# Altium project task11.3.PrjPcb
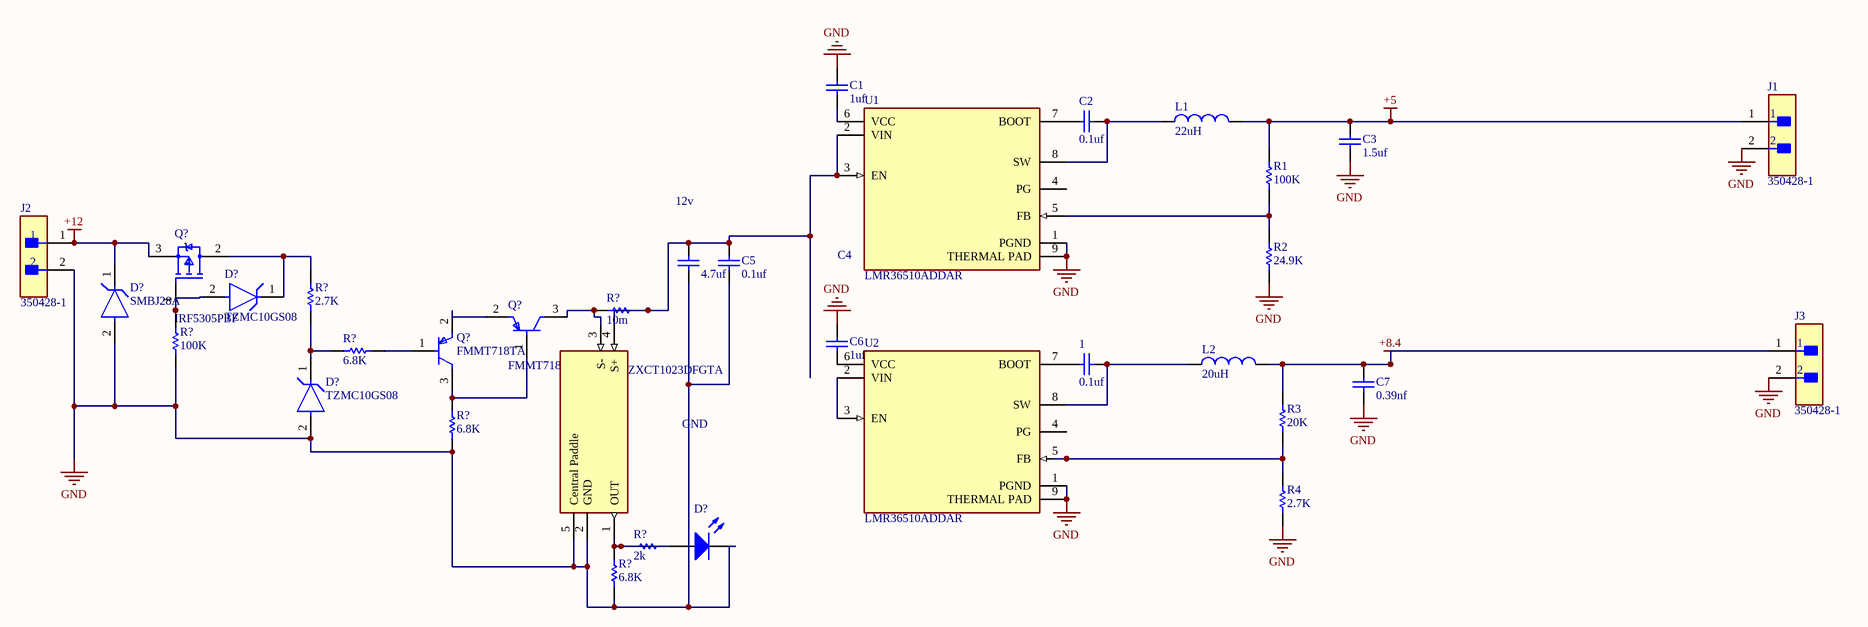
[diagram p0: Sheet1.SchDoc]
1 sheet, 34 parts. Net scope: global (net labels, ports and power ports of the same name join across sheets).
Board file: PCB1.PcbDoc

## Sheet Sheet1.SchDoc
size B; SheetNumber: 1; SheetTotal: 1

### Parts
(Parts that share a designator on the sheet are numbered #1, #2 ... from top to bottom, then left to right.)
1  value 0.1uf  (hidden comment: Capacitor)
C1  value 1uf  (hidden comment: Capacitor)
C2  value 0.1uf  (hidden comment: Capacitor)
C3  value 1.5uf  (hidden comment: Capacitor)
C4  value 4.7uf  (hidden comment: Capacitor)
C5  value 0.1uf  (hidden comment: Capacitor)
C6  value 1uf  (hidden comment: Capacitor)
C7  value 0.39nf  (hidden comment: Capacitor)
D?#1  TZMC10GS08  [FP-6_560-5005_01-4-MFG]
D?#2  SMBJ28A  [FP-SMBJ-MFG]
D?#3  TZMC10GS08  [FP-6_560-5005_01-4-MFG]
D?#4  Light-Emitting Diode  (value not drawn)
J1  350428-1  [FP-350428-1-MFG]
J2  350428-1  [FP-350428-1-MFG]
J3  350428-1  [FP-350428-1-MFG]
L1  value 22uH  (hidden comment: Inductor)
L2  value 20uH  (hidden comment: Inductor)
Q?#1  IRF5305PBF  [FP-PG-TO220-3-0]
Q?#2  FMMT718TA  [FP-SOT23-MFG]
Q?#3  FMMT718TA  [FP-SOT23-MFG]
R1  value 100K  (hidden comment: Resistor)
R2  value 24.9K  (hidden comment: Resistor)
R3  value 20K  (hidden comment: Resistor)
R4  value 2.7K  (hidden comment: Resistor)
R?#1  value 10m  (hidden comment: Resistor)
R?#2  value 2.7K  (hidden comment: Resistor)
R?#3  value 6.8K  (hidden comment: Resistor)
R?#4  value 100K  (hidden comment: Resistor)
R?#5  value 6.8K  (hidden comment: Resistor)
R?#6  value 6.8K  (hidden comment: Resistor)
R?#7  value 2k  (hidden comment: Resistor)
U1  LMR36510ADDAR  [FP-DDA0008E-IPC_A]
U2  LMR36510ADDAR  [FP-DDA0008E-IPC_A]
  ZXCT1023DFGTA  [FP-TDFN1218-4-MFG]

### Nets
+5: C3.2 J1.1 L1.2 R1.2
+8.4: C7.2 J3.1 L2.2 R3.2
+12: D?#2.1(C) J2.1 Q?#1.3(S)
GND: C1.2 C3.1 C4.1 C5.1 C6.2 C7.1 D?#2.2(A) D?#3.2(A) D?#4.2(K) J1.2 J2.2 J3.2 R2.1 R4.1 R?#4.1 R?#5.2 R?#6.2 U1.1(PGND) U1.9(THERMAL_PAD) U2.1(PGND) U2.9(THERMAL_PAD) .2(GND) .5(Central_Paddle)
Net1_1: 1.1 L2.1 U2.8(SW)
Net1_2: 1.2 U2.7(BOOT)
NetC1_1: C1.1 U1.6(VCC)
NetC2_1: C2.1 U1.7(BOOT)
NetC2_2: C2.2 L1.1 U1.8(SW)
NetC4_2: C4.2 C5.2 R?#1.1 U1.2(VIN) U1.3(EN) .4(S+)
NetC6_1: C6.1 U2.6(VCC)
NetD?#1_1: D?#1.1(C) Q?#1.2(D) R?#2.2
NetD?#1_2: D?#1.2(A) Q?#1.1(G) R?#4.2
NetD?#3_1: D?#3.1(C) R?#2.1 R?#3.2
NetD?#4_1: D?#4.1(A) R?#6.1 R?#7.1 .1(OUT)
NetQ?#2_1: Q?#2.1(B) R?#3.1
NetQ?#2_2: Q?#2.2(E) Q?#3.2(E)
NetQ?#2_3: Q?#2.3(C) Q?#3.1(B) R?#5.1
NetQ?#3_3: Q?#3.3(C) R?#1.2 .3(S-)
NetR1_1: R1.1 R2.2 U1.5(FB)
NetR3_1: R3.1 R4.2 U2.5(FB)
NetU2_2: U2.2(VIN) U2.3(EN)

Not connected (* = marked no-connect by the designer): R?#7 2; U1 4(PG); U2 4(PG)

### Notes on the sheet
- 12v
- GND

### Library data of the parts
1 C1-C7 = Capacitor: SimulationGenericComponent: True
D?#1 D?#3 = CMP-00030-07941520-1: TZMC10GS08 Diode Zener Single 10 Volt 5% 500mW 2-Pin Quadro MELF SOD-80 Tape and Reel; Forward Voltage: 1.5V; Zener Voltage: 10V; Current: 1A; Max Reverse Leakage Current: 100nA; Peak Reverse Current: 100mA; Test Current: 5mA; Impedance: 15Ω; Number of Pins: 2; Tolerance: 5%; Height: 1.6mm; Power Dissipation: 500mW; Min Operating Temperature: -65°C; NexarPartId: 7941520; Max Operating Temperature: 175°C; Lead Free: Lead Free; Width: 1.6mm; Voltage Tolerance: 5%; Element Configuration: Single; Max Power Dissipation: 500mW; Voltage: 10V; RoHS: Compliant; Radiation Hardening: No; Schedule B: 8541100050, 8541100050; Mount: Surface Mount; Working Voltage: 10V; Length: 3.7mm
D?#2 = CMP-08607-000081-1: TVS DIODE 28V 45.4V DO214AA; Manufacturer: Littelfuse Inc; Breakdown Voltage: 31.1V; Direction: Unidirectional; Number Of Channels: 1; Peak Pulse Power: 600W; Max Junction Temp: +150°C; Description: 45.4V Clamp 13.3A Ipp Tvs Diode Surface Mount DO-214AA (SMBJ); Peak Pulse Current: 13.3A; Temperature: -65°C to +150°C; Category: Diode; RoHS: TRUE; Height: 2.61mm; Reverse Standoff Voltage: 28V; Device Class L1: Circuit Protection; Temperature Range Low: -65°C; ComponentLink2Description: Datasheet; Digikey Description: TVS DIODE 28V 45.4V DO214AA; Automotive: No; Package: SMBJ; Mouser Description: Littelfuse SMBJ28A, Uni-Directional TVS Diode, 600W, 2-Pin DO-214AA; ComponentLink2URL: https://www.littelfuse.com/~/media/electronics/datasheets/tvs_diodes/littelfuse_tvs_diode_smbj_datasheet.pdf.pdf; Manufacturer Part Number: SMBJ28A; Octopart: https://octopart.com/smbj28a-littelfuse-350790; Clamping Voltage: 45.4V; Temperature Range High: +150°C; Device Class L3: unset; Device Class L2: TVS Diodes; Lead Free: Yes
D?#4 = LED: AF: 1; BV: 0; BV_MAX: 1e99; EG: 1.11; FC: 0.5; IBV: 0.001; IS: 1e-14; MJSW: 0.33; NTUN: 30; TNOM: 27; XTI: 3; SimulationGenericComponent: True; CJO: 0; CJP: 0; CTA: 0; CTP: 0; FCS: 0.5; FV_MAX: 1e99; IKF: 0; IKR: 0; ISR: 1e-14; JSW: 0; JTUN: 0; JTUNSW: 0; KEG: 1; KF: 0; LEVEL: 1; N: 1; NBV: 1; NR: 1; NS: 1; PHP: 1; RS: 0; TCV: 0; TLEV: 0; TLEVC: 0; TM1: 0; TM2: 0; TPB: 0; TPHP: 0; TRS: 0; TRS2: 0; TT: 0; TTT1: 0; TTT2: 0; VJ: 1; XTITUN: 3
J1-J3 = CMP-03369-000080-1: CONN HEADER VERT 2POS 6.35MM; Manufacturer: TE Connectivity; Standoff Height: 0.63mm; Number Of Contacts: 2; Conn Gender: Male; Voltage Rating: 600V; Conn Orientation: Vertical; Current Rating: 12A; Number Of Rows: 1; Mouser Description: Connector, Soft Shell; Universal MATE-N-LOK; 2; Nylon; Natural; 19 A; 600 VAC; Height: 14.99mm; Pitch: 6.35mm; ComponentLink2URL: https://www.te.com/commerce/DocumentDelivery/DDEController?Action=showdoc&DocId=Customer+Drawing%7F350428%7FY2%7Fpdf%7FEnglish%7FENG_CD_350428_Y2.pdf%7F350428-1; Device Class L1: Connectors; Automotive: No; Octopart: https://octopart.com/350428-1-te+connectivity-46505355; Digikey Description: CONN HEADER VERT 2POS 6.35MM; RoHS: TRUE; Temperature: -40°C to +105°C; Contact Material: Gold,Nickel; Package: 350428-1; Temperature Range Low: -40°C; Device Class L3: unset; Lead Free: Yes; Device Class L2: Headers and Wire Housings; Category: Conn; ComponentLink2Description: Datasheet; Temperature Range High: +105°C; Manufacturer Part Number: 350428-1
L1 L2 = Inductor: SimulationGenericComponent: True
Q?#1 = CMP-32901-000003-1: MOSFET P-CH 55V 31A TO-220AB; Manufacturer: Infineon; Max Forward Diode Voltage: -1.3V; Continuous Drain Current: -31A; Standoff Height: 3.55mm; Power Dissipation: 110W; Number Of Channels: 1; Rthja Max: 62°C/W; Depletion Mode: False; Drain To Source Resistance: 0.06Ω; Input Capacitace At Vds: 1200pF @ -25V; Reverse Recovery Time: 71ns; Gate Charge At Vgs: 63nC @ -10V; Gate To Source Voltage: 20V; Turn Off Delay Time: 39ns; Turn On Delay Time: 14ns; Drain To Source Breakdown Voltage: -55V; Threshold Vgs Min: -2V; Max Junction Temp: +175°C; Pulse Drain Current: -110A; Reverse Recovery Charge: 170nC; Threshold Vgs Max: -4V; Device Class L1: Discrete Semiconductors; Lead Free: Yes; Temperature Range High: +175°C; Device Class L2: Transistors; Package: PG-TO220-3; Octopart: https://octopart.com/irf5305pbf-infineon-65873396; RoHS: TRUE; Number Of P Channels: 1; Manufacturer Part Number: IRF5305PBF; Category: Trans; Digikey Description: MOSFET P-CH 55V 31A TO-220AB; Device Class L3: MOSFETs; Height: 19.3mm; Automotive: No; Temperature Range Low: -55°C; Temperature: -55°C to +175°C; ComponentLink2URL: https://www.infineon.com/dgdl/irf5305pbf.pdf?fileId=5546d462533600a4015355e370101993; Drain To Source Voltage: -55V; ComponentLink2Description: Datasheet
Q?#2 Q?#3 = CMP-2000-06277-2: TRANS PNP 20V 1.5A SOT23-3; Manufacturer: Diodes Inc.; Collector Base Voltage: -20V; Automotive Grade: Grade 0; Unity Gain Freq: 180MHz; Collector Emitter Breakdown Voltage: -55V; Collector Emitter Saturation Voltage: -145mV; Hfe Min: 30; Rthja Max: 200°C/W; Hfe Max: 475; Number Of Elements: 1; Max Collector Current: -1.5A; Emitter Base Voltage: -7V; Description: Bipolar (BJT) Transistor PNP 20V 1.5A 180MHz 625mW Surface Mount SOT-23-3; Power Dissipation: 625mW; Max Junction Temp: +150°C; Standoff Height: 0.013mm; Category: Trans; Octopart: https://octopart.com/fmmt718ta-diodes+inc.-356404; Collector Emitter Voltage: -20V; Height: 1.1mm; RoHS: TRUE; Automotive: Yes; ComponentLink2Description: Datasheet; Temperature: -55°C to +150°C; Digikey Description: TRANS PNP 20V 1.5A SOT23-3; Footprint Url: https://www.diodes.com/assets/Package-Files/SOT23.pdf; Device Class L2: Transistors; Package: SOT23; Temperature Range High: +150°C; Mouser Description: Bipolar Transistors - BJT PNP SuperSOT; ComponentLink2URL: https://www.diodes.com/assets/Datasheets/FMMT718.pdf; Device Class L1: Discrete Semiconductors; Device Class L3: BJTs; Number Of Pnp: 1; Manufacturer Part Number: FMMT718TA; Lead Free: Yes; Temperature Range Low: -55°C
R1-R4 R?#1-R?#7 = Resistor: TC1: 0; SimulationGenericComponent: True; TC2: 0
U1 U2 = CMP-04918-000232-1: 65V 2.5A SYNCHRONOUS BUCK CONVER; RoHS Compliant: Yes
 = CMP-12749-000001-1: IC CUR SENSE MONITOR 4-TDFN; Input Current: 100nA; Bandwidth: 1MHz; Operating Supply Current: 3.5uA; Gain: 50dB; Quiescent Current: 3.5A; Max Supply Voltage: 20V; Accuracy: 3%; Min Supply Voltage: 2.5V; Packaging: Tape and Reel; Mount: Surface Mount; Package Quantity: 3000; Number of Pins: 4; Min Operating Temperature: -40°C; Radiation Hardening: No; Max Operating Temperature: 85°C; REACH SVHC: No SVHC; Lead Free: Lead Free; Weight: 0.001764oz